# EAGLE schematic adv-w20 (EAGLE 9.5.2)
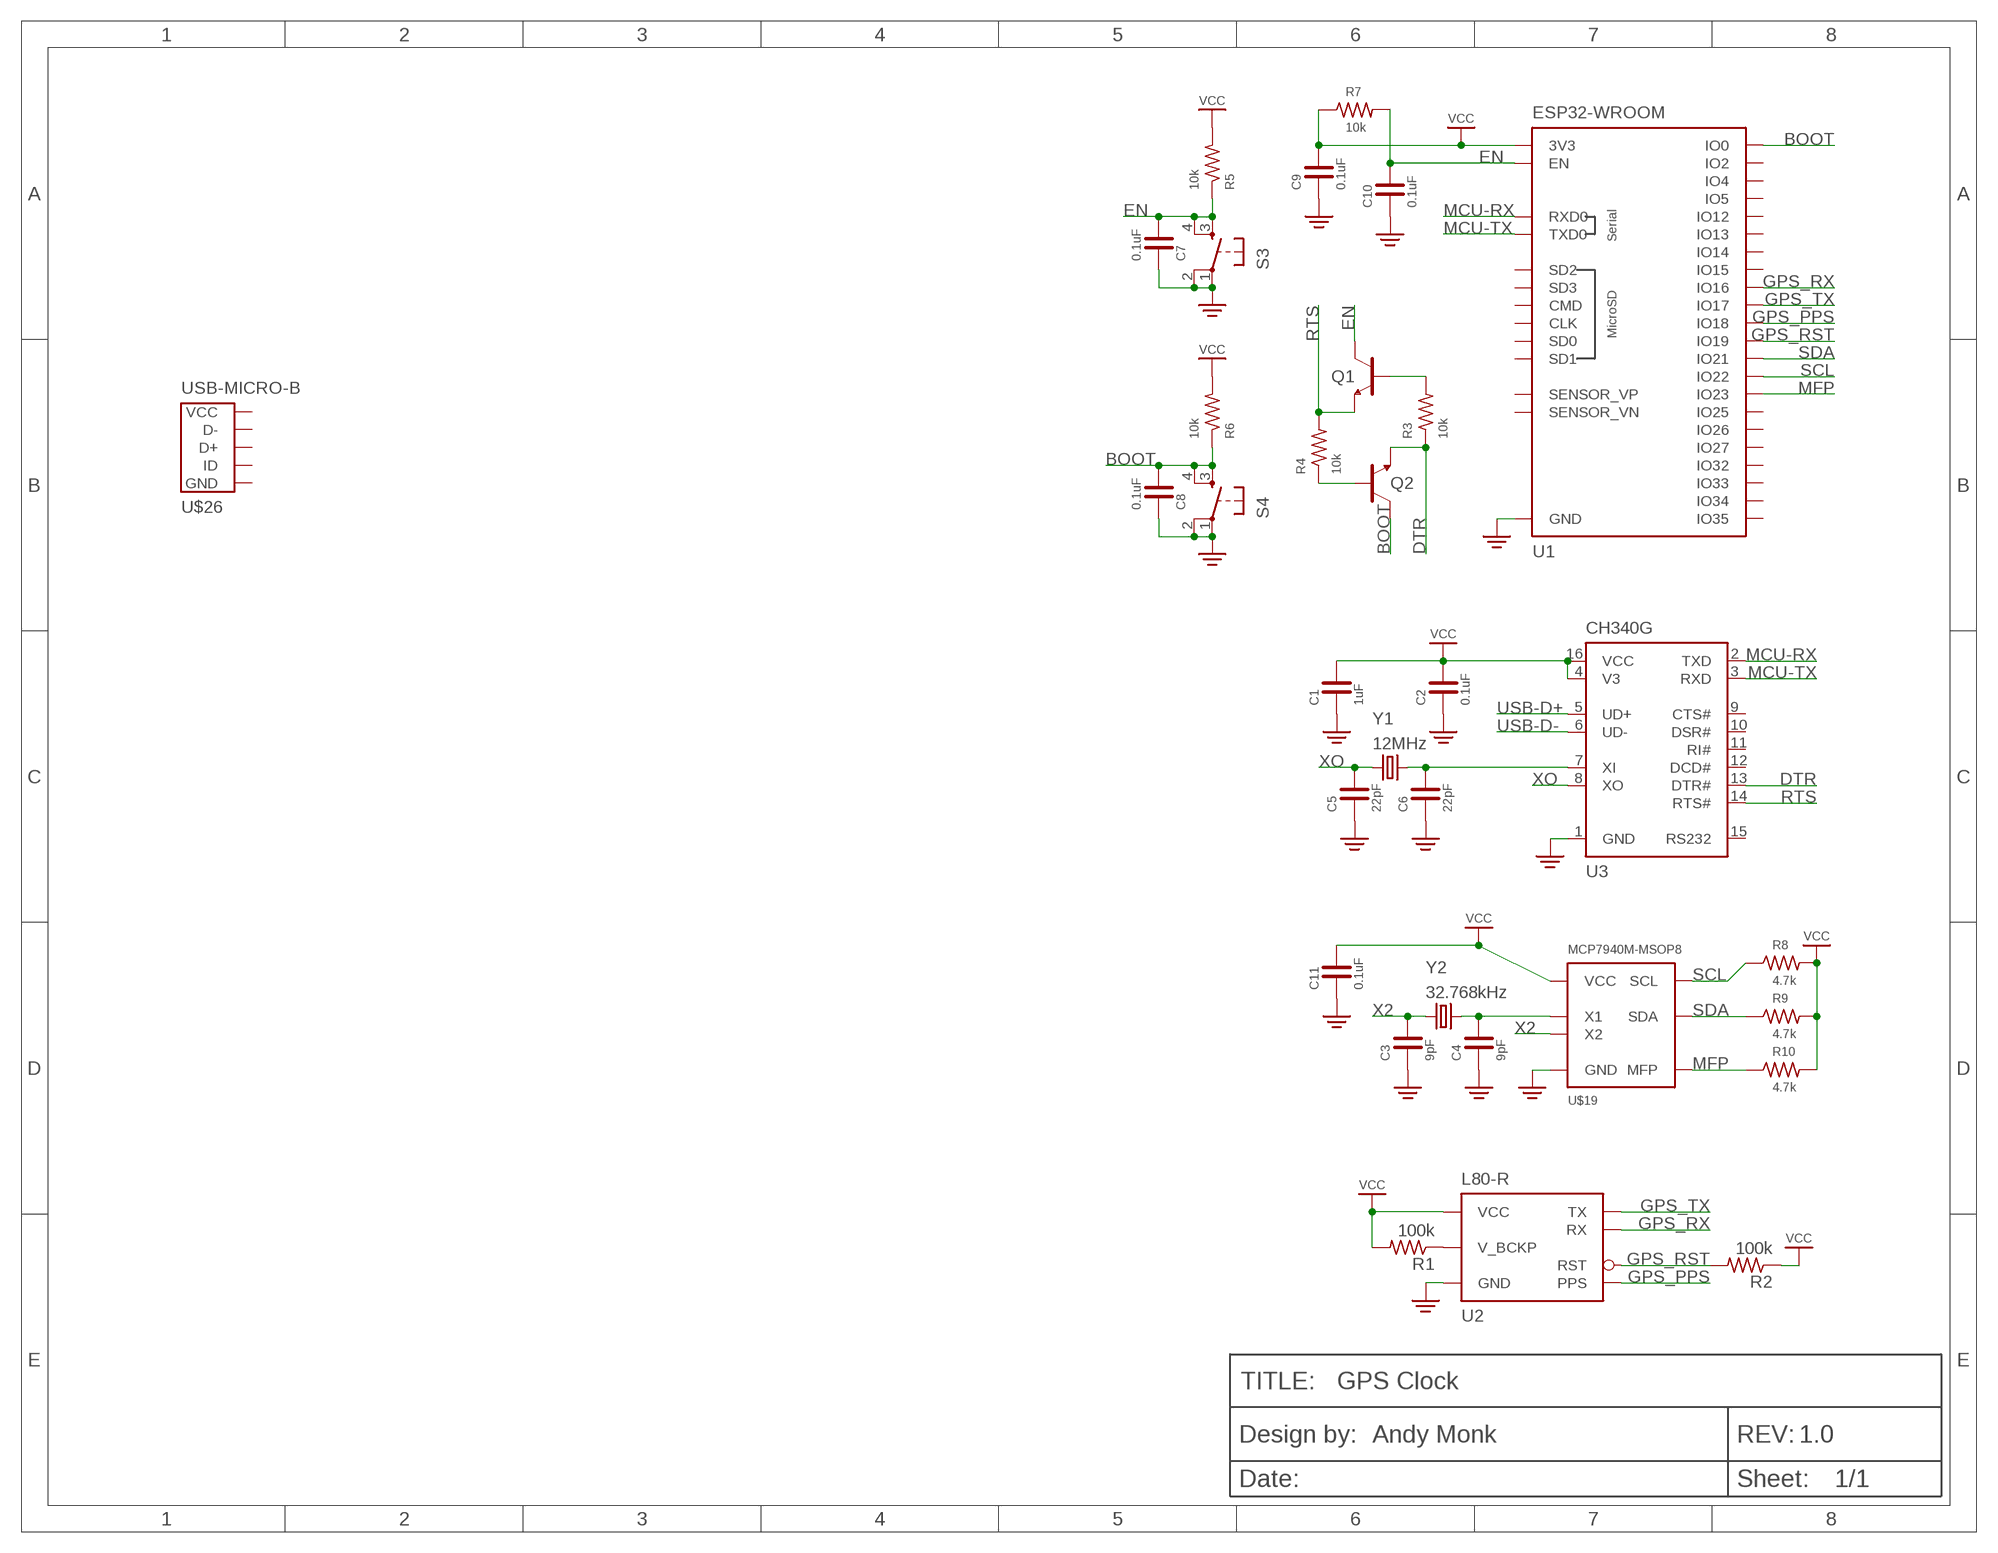
[diagram p0: schematic, sheet 1]

## Parts
C1  1uF  C_CHIP  [0805]
C2  0.1uF  C_CHIP  [0805]
C3  9pF  C_CHIP  [0805]
C4  9pF  C_CHIP  [0805]
C5  22pF  C_CHIP  [0805]
C6  22pF  C_CHIP  [0805]
C7  0.1uF  C_CHIP  [0805]
C8  0.1uF  C_CHIP  [0805]
C9  0.1uF  C_CHIP  [0805]
C10  0.1uF  C_CHIP  [0805]
C11  0.1uF  C_CHIP  [0805]
Q1  NPN  [SOT-23]
Q2  NPN  [SOT-23]
R1  100k  R-US_R0805  [R0805]
R2  100k  R-US_R0805  [R0805]
R3  10k  R_CHIP  [0805]
R4  10k  R_CHIP  [0805]
R5  10k  R_CHIP  [0805]
R6  10k  R_CHIP  [0805]
R7  10k  R_CHIP  [0805]
R8  4.7k  R_CHIP  [0805]
R9  4.7k  R_CHIP  [0805]
R10  4.7k  R_CHIP  [0805]
S3  TAC_SWITCHPTH  [TACTILE-PTH]
S4  TAC_SWITCHPTH  [TACTILE-PTH]
U1  ESP32-WROOM  [ESP32-WROOM]
U2  L80-R  [L80-R]
U3  CH340G  [SOIC16]
U$1  FRAME-BADGE  [DUMMY]
U$19  MCP7940M-MSOP8  [SOP65P490X110-8N]
U$26  USB-MICRO-B  [USB-MICRO-B]
Y1  12MHz  CRYSTALHC49S  [HC49/S]
Y2  32.768kHz  XTAL  [TC26H]

## Nets
BOOT: C8.1 Q2.3(C) R6.1 S4.3 S4.4 U1.IO0
DTR: Q2.2(E) R3.1 U3.13(DTR#)
EN: C7.1 C10.1 Q1.3(C) R5.1 R7.2 S3.3 S3.4 U1.EN
GND: C1.2 C2.2 C3.2 C4.2 C5.2 C6.2 C7.2 C8.2 C9.2 C10.2 C11.2 S3.1 S3.2 S4.1 S4.2 U1.GND@0(GND) U1.GND@1(GND) U1.GND@2(GND) U2.GND@0(GND) U2.GND@1(GND) U3.1(GND) U$19.4(GND)
GPS_PPS: U1.IO18 U2.PPS
GPS_RST: R2.2 U1.IO19 U2.RST
GPS_RX: U1.IO16 U2.RX
GPS_TX: U1.IO17 U2.TX
MCU-RX: U1.RXD0 U3.2(TXD)
MCU-TX: U1.TXD0 U3.3(RXD)
MFP: R10.1 U1.IO23 U$19.7(MFP)
N$1: R1.1 U2.V_BCKP
N$2: C6.1 U3.7(XI) Y1.2
N$3: C4.1 U$19.1(X1) Y2.P$2
N$4: Q2.1(B) R4.1
N$7: Q1.1(B) R3.2
RTS: Q1.2(E) R4.2 U3.14(RTS#)
SCL: R8.1 U1.IO22 U$19.6(SCL)
SDA: R9.1 U1.IO21 U$19.5(SDA)
USB-D+: U3.5(UD+)
USB-D-: U3.6(UD-)
VCC: C1.1 C2.1 C9.1 C11.1 R1.2 R2.1 R5.2 R6.2 R7.1 R8.2 R9.2 R10.2 U1.3V3 U2.VCC U3.4(V3) U3.16(VCC) U$19.8(VCC)
X2: C3.1 U$19.2(X2) Y2.P$1
XO: C5.1 U3.8(XO) Y1.1
Unconnected: U1.CLK U1.CMD U1.IO2 U1.IO4 U1.IO5 U1.IO12 U1.IO13 U1.IO14 U1.IO15 U1.IO25 U1.IO26 U1.IO27 U1.IO32 U1.IO33 U1.IO34 U1.IO35 U1.SD0 U1.SD1 U1.SD2 U1.SD3 U1.SENSOR_VN U1.SENSOR_VP U3.9(CTS#) U3.10(DSR#) U3.11(RI#) U3.12(DCD#) U3.15(RS232) U$26.D+ U$26.D- U$26.GND U$26.GND0(GND) U$26.GND1(GND) U$26.GND2(GND) U$26.GND3(GND) U$26.GND4(GND) U$26.GND5(GND) U$26.ID U$26.VCC

## Notes on the sheet
- GPS Clock
- Andy Monk | 1.0

## Library data of the parts
C1-C11 = may2019-teaching:C_CHIP
Q1 Q2 = may2019-teaching:NPN
R1 R2 = adafruit:R-US_: RESISTOR, American symbol
R3-R10 = may2019-teaching:R_CHIP
S3 S4 = may2019-teaching:TAC_SWITCH: Momentary Switch Button commonly used for reset or general input. Spark Fun Electronics SKU : COM-00097 SMT- SWCH-08247
U1 = adv-w20:ESP32-WROOM
U2 = adv-w20:L80-R
U3 = may2019-teaching:CH340G
U$1 = nordin-pga and filter:FRAME-BADGE
U$19 = adv-w20:MCP7940M
U$26 = may2019-teaching:USB-MICRO-B
Y1 = adafruit:CRYSTAL: CRYSTAL; OC_FARNELL: 1667008; OC_NEWARK: unknown
Y2 = adv-w20:XTAL